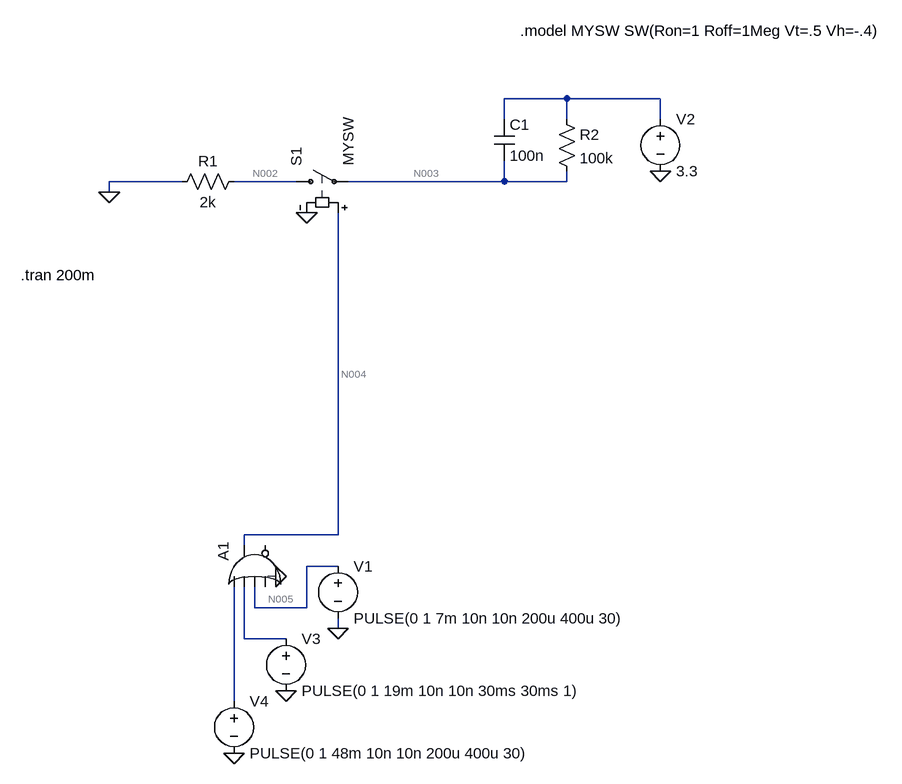
[diagram p0: schematic Button Debounce.asc]
Button Debounce.asc, the LTspice schematic file:
Version 4
SHEET 1 1040 884
WIRE 432 -144 336 -144
WIRE 576 -144 432 -144
WIRE 336 -112 336 -144
WIRE 432 -112 432 -144
WIRE 576 -112 576 -144
WIRE -160 -16 -272 -16
WIRE 16 -16 -80 -16
WIRE 336 -16 336 -48
WIRE 336 -16 96 -16
WIRE 432 -16 432 -32
WIRE 432 -16 336 -16
WIRE -272 0 -272 -16
WIRE 80 528 80 32
WIRE 80 528 -64 528
WIRE -64 544 -64 528
WIRE 80 576 32 576
WIRE -48 640 -48 608
WIRE 32 640 32 576
WIRE 32 640 -48 640
WIRE 80 672 80 656
WIRE -64 688 -64 608
WIRE 0 688 -64 688
WIRE -80 784 -80 608
FLAG 80 672 0
FLAG 32 32 0
FLAG 576 -32 0
FLAG -272 0 0
FLAG 0 768 0
FLAG -80 864 0
FLAG -16 592 0
SYMBOL voltage 80 560 R0
WINDOW 123 0 0 Left 0
WINDOW 39 0 0 Left 0
SYMATTR InstName V1
SYMATTR Value PULSE(0 1 7m 10n 10n 200u 400u 30)
SYMBOL sw 0 -16 R270
SYMATTR InstName S1
SYMATTR Value MYSW
SYMBOL voltage 576 -128 R0
WINDOW 123 0 0 Left 0
WINDOW 39 0 0 Left 0
SYMATTR InstName V2
SYMATTR Value 3.3
SYMBOL res -64 -32 R90
WINDOW 0 0 56 VBottom 2
WINDOW 3 32 56 VTop 2
SYMATTR InstName R1
SYMATTR Value 2k
SYMBOL cap 320 -112 R0
SYMATTR InstName C1
SYMATTR Value 100n
SYMBOL res 416 -128 R0
SYMATTR InstName R2
SYMATTR Value 100k
SYMBOL voltage 0 672 R0
WINDOW 123 0 0 Left 0
WINDOW 39 0 0 Left 0
SYMATTR InstName V3
SYMATTR Value PULSE(0 1 19m 10n 10n 30ms 30ms 1)
SYMBOL voltage -80 768 R0
WINDOW 123 0 0 Left 0
WINDOW 39 0 0 Left 0
SYMATTR InstName V4
SYMATTR Value PULSE(0 1 48m 10n 10n 200u 400u 30)
SYMBOL Digital\\or -112 576 R270
SYMATTR InstName A1
TEXT -408 128 Left 2 !.tran 200m
TEXT 360 -248 Left 2 !.model MYSW SW(Ron=1 Roff=1Meg Vt=.5 Vh=-.4)

The netlist it stands for:
* Button Debounce.asc
V1 N005 0 PULSE(0 1 7m 10n 10n 200u 400u 30)
S1 N002 N003 N004 0 MYSW
V2 N001 0 3.3
R1 N002 0 2k
C1 N001 N003 100n
R2 N001 N003 100k
V3 N006 0 PULSE(0 1 19m 10n 10n 30ms 30ms 1)
V4 N007 0 PULSE(0 1 48m 10n 10n 200u 400u 30)
A1 N007 N006 N005 0 0 0 N004 0 OR
.tran 200m
.model MYSW SW(Ron=1 Roff=1Meg Vt=.5 Vh=-.4)
.backanno
.end

* Results of the author's LTspice run, read from the files saved beside the schematic
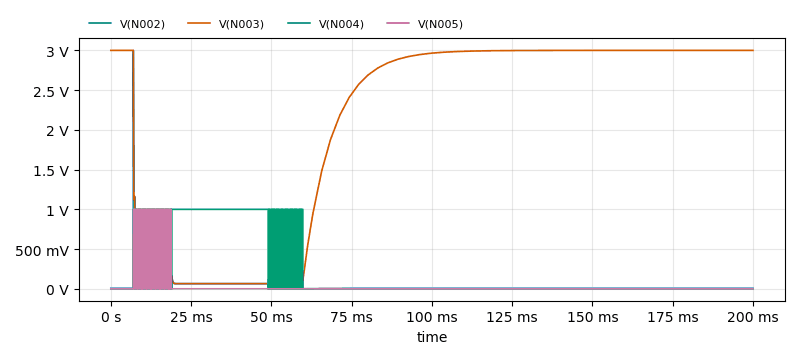
[diagram p1: Transient Analysis of Button Debounce.asc, plotted from the saved traces]
* Transient Analysis, 1 run:
*   V(N002): min 129.2 µV, max 2.999 V, average 23.92 mV, rms 79.44 mV, last 5.989 mV
*   V(N003): min 64.74 mV, max 3.001 V, average 2.104 V, rms 2.456 V, last 3.001 V
*   V(N004): min 0 V, max 1 V, average 207 mV, rms 455 mV, last 0 V
*   V(N005): min 0 V, max 1 V, average 30 mV, rms 173.2 mV, last 0 V